# EAGLE design dds (EAGLE 6.2)
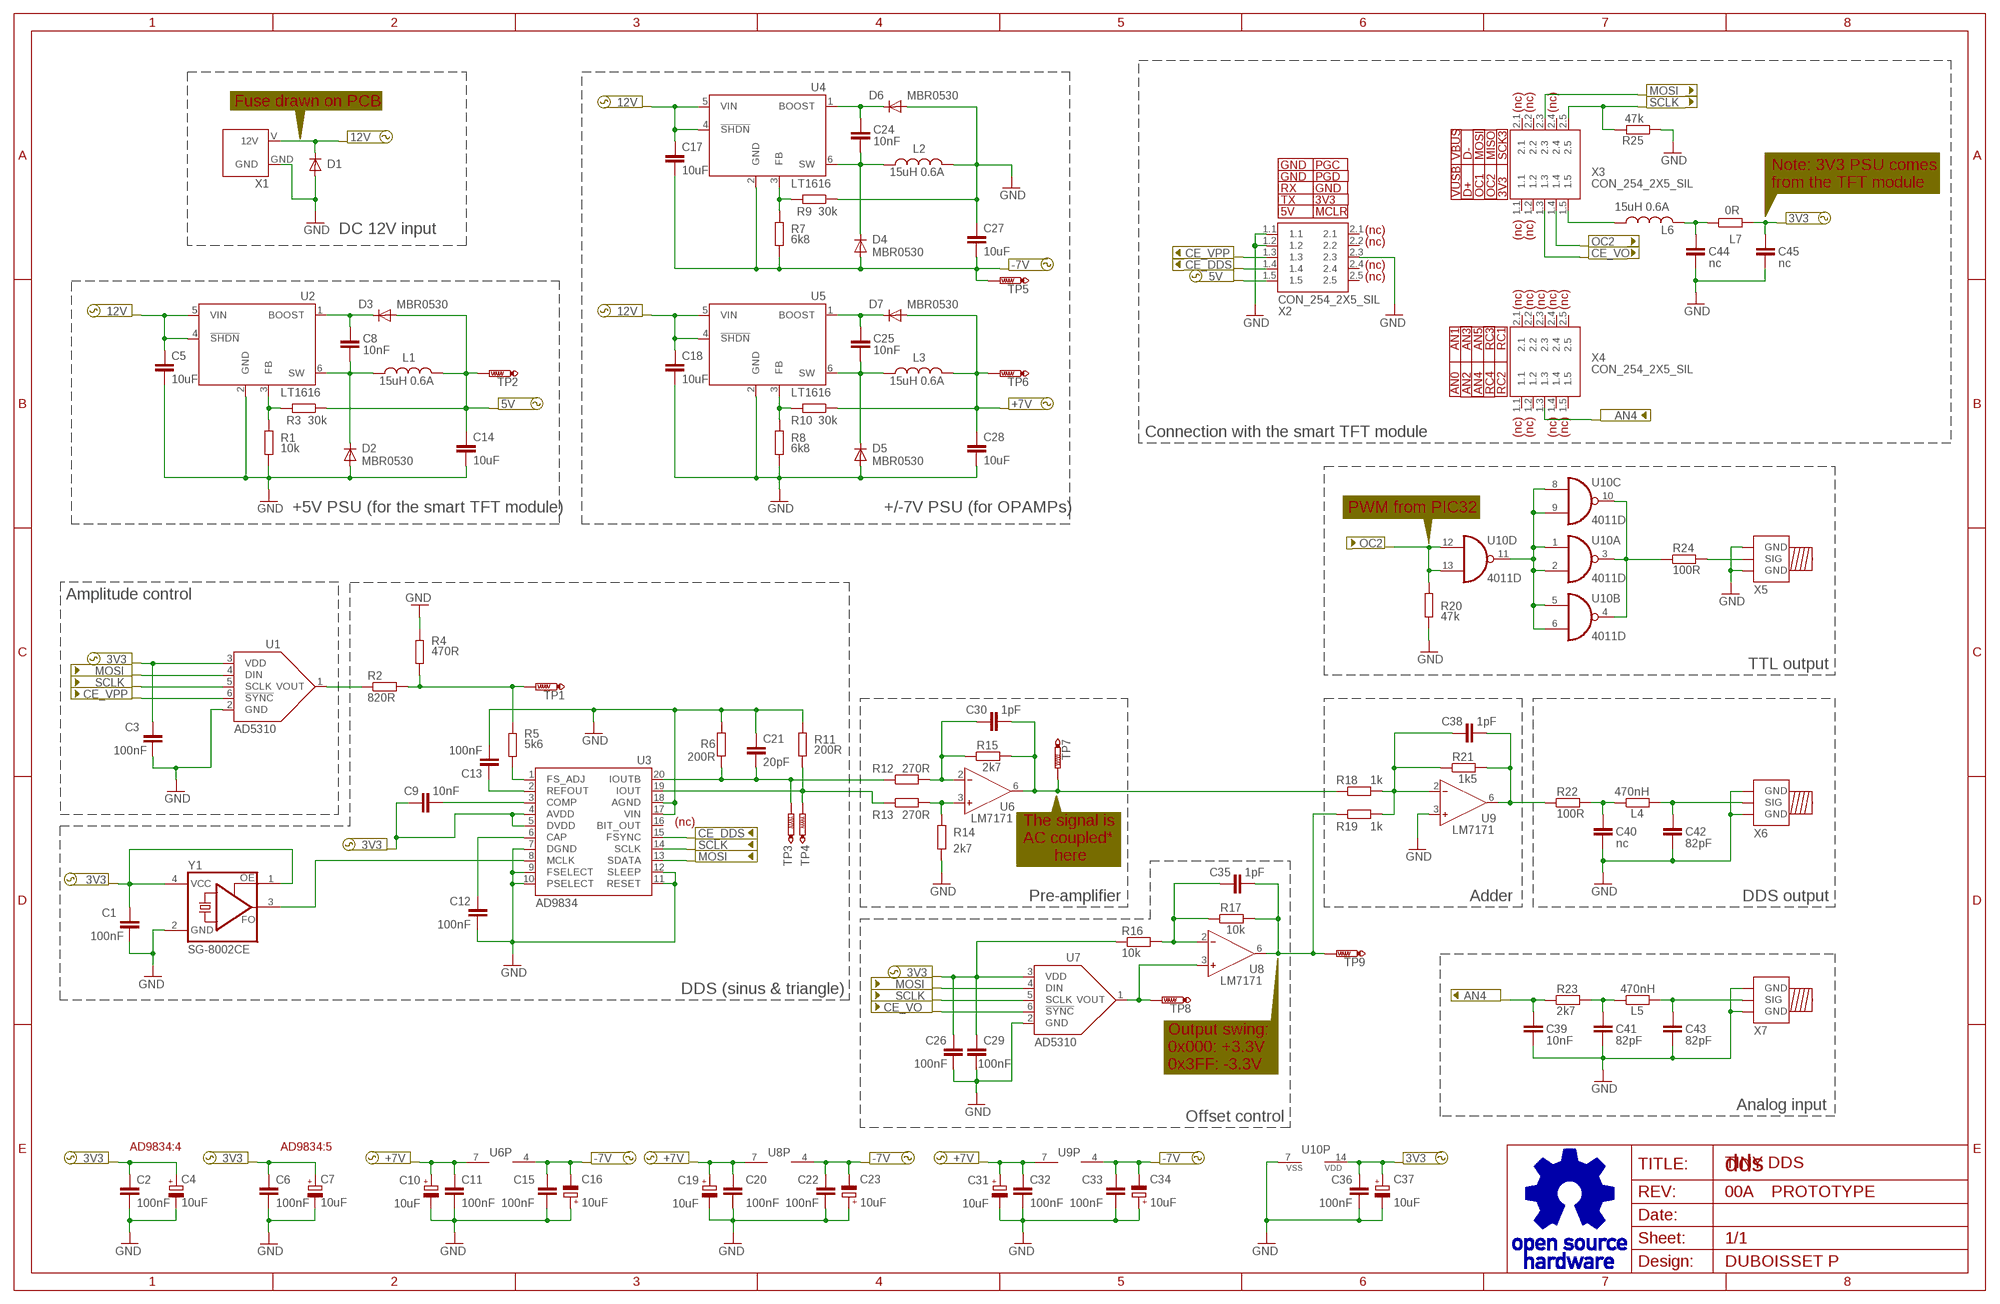
[diagram p0: schematic, sheet 1]

## Parts
C1  100nF  C-EUC0603  [C0603]
C2  100nF  C-EUC0603  [C0603]
C3  100nF  C-EUC0603  [C0603]
C4  10uF  CPOL-EUSMCB  [SMC_B]
C5  10uF  C-EUC0805  [C0805]
C6  100nF  C-EUC0603  [C0603]
C7  10uF  CPOL-EUSMCB  [SMC_B]
C8  10nF  C-EUC0603  [C0603]
C9  10nF  C-EUC0603  [C0603]
C10  10uF  CPOL-EUSMCB  [SMC_B]
C11  100nF  C-EUC0603  [C0603]
C12  100nF  C-EUC0603  [C0603]
C13  100nF  C-EUC0603  [C0603]
C14  10uF  C-EUC0805  [C0805]
C15  100nF  C-EUC0603  [C0603]
C16  10uF  CPOL-EUSMCB  [SMC_B]
C17  10uF  C-EUC0805  [C0805]
C18  10uF  C-EUC0805  [C0805]
C19  10uF  CPOL-EUSMCB  [SMC_B]
C20  100nF  C-EUC0603  [C0603]
C21  20pF  C-EUC0603  [C0603]
C22  100nF  C-EUC0603  [C0603]
C23  10uF  CPOL-EUSMCB  [SMC_B]
C24  10nF  C-EUC0603  [C0603]
C25  10nF  C-EUC0603  [C0603]
C26  100nF  C-EUC0603  [C0603]
C27  10uF  C-EUC0805  [C0805]
C28  10uF  C-EUC0805  [C0805]
C29  100nF  C-EUC0603  [C0603]
C30  1pF  C-EUC0603  [C0603]
C31  10uF  CPOL-EUSMCB  [SMC_B]
C32  100nF  C-EUC0603  [C0603]
C33  100nF  C-EUC0603  [C0603]
C34  10uF  CPOL-EUSMCB  [SMC_B]
C35  1pF  C-EUC0603  [C0603]
C36  100nF  C-EUC0603  [C0603]
C37  10uF  CPOL-EUSMCB  [SMC_B]
C38  1pF  C-EUC0603  [C0603]
C39  10nF  C-EUC0603  [C0603]
C40  nc  C-EUC0603  [C0603]
C41  82pF  C-EUC0603  [C0603]
C42  82pF  C-EUC0603  [C0603]
C43  82pF  C-EUC0603  [C0603]
C44  nc  C-EUC0603  [C0603]
C45  nc  C-EUC0603  [C0603]
D1  DIODE-SMB  [SMB]
D2  MBR0530  DIODE-SOD123  [SOD123]
D3  MBR0530  DIODE-SOD123  [SOD123]
D4  MBR0530  DIODE-SOD123  [SOD123]
D5  MBR0530  DIODE-SOD123  [SOD123]
D6  MBR0530  DIODE-SOD123  [SOD123]
D7  MBR0530  DIODE-SOD123  [SOD123]
L1  15uH 0.6A  L_TDK_15UH  [L5X3]
L2  15uH 0.6A  L_TDK_15UH  [L5X3]
L3  15uH 0.6A  L_TDK_15UH  [L5X3]
L4  470nH  R-EU_R0603  [R0603]
L5  470nH  R-EU_R0603  [R0603]
L6  15uH 0.6A  L_TDK_15UH  [L5X3]
L7  0R  R-EU_R0603  [R0603]
R1  10k  R-EU_R0603  [R0603]
R2  820R  R-EU_R0603  [R0603]
R3  30k  R-EU_R0603  [R0603]
R4  470R  R-EU_R0603  [R0603]
R5  5k6  R-EU_R0603  [R0603]
R6  200R  R-EU_R0603  [R0603]
R7  6k8  R-EU_R0603  [R0603]
R8  6k8  R-EU_R0603  [R0603]
R9  30k  R-EU_R0603  [R0603]
R10  30k  R-EU_R0603  [R0603]
R11  200R  R-EU_R0603  [R0603]
R12  270R  R-EU_R0603  [R0603]
R13  270R  R-EU_R0603  [R0603]
R14  2k7  R-EU_R0603  [R0603]
R15  2k7  R-EU_R0603  [R0603]
R16  10k  R-EU_R0603  [R0603]
R17  10k  R-EU_R0603  [R0603]
R18  1k  R-EU_R0603  [R0603]
R19  1k  R-EU_R0603  [R0603]
R20  47k  R-EU_R0603  [R0603]
R21  1k5  R-EU_R0603  [R0603]
R22  100R  R-EU_R0603  [R0603]
R23  2k7  R-EU_R0603  [R0603]
R24  100R  R-EU_R0603  [R0603]
R25  47k  R-EU_R0603  [R0603]
TP1  PTR1B1,27  [B1,27]
TP2  PTR1B1,27  [B1,27]
TP3  PTR1B1,27  [B1,27]
TP4  PTR1B1,27  [B1,27]
TP5  PTR1B1,27  [B1,27]
TP6  PTR1B1,27  [B1,27]
TP7  PTR1B1,27  [B1,27]
TP8  PTR1B1,27  [B1,27]
TP9  PTR1B1,27  [B1,27]
U1  AD5310  [SOT23-6]
U2  LT1616  [SOT23-6]
U3  AD9834  [TSSOP20]
U4  LT1616  [SOT23-6]
U5  LT1616  [SOT23-6]
U6  LM7171  AD811_SO8  [SO8]
U7  AD5310  [SOT23-6]
U8  LM7171  AD811_SO8  [SO8]
U9  LM7171  AD811_SO8  [SO8]
U10  4011D  [SO14]
X1  CON_12V  [CON_12V]
X2  CON_254_2X5_SIL  [2X5_SIL]
X3  CON_254_2X5_SIL  [2X5_SIL]
X4  CON_254_2X5_SIL  [2X5_SIL]
X5  CON_SMA  [SMA_SMD]
X6  CON_SMA  [SMA_SMD]
X7  CON_SMA  [SMA_SMD]
Y1  SG-8002CE  ASF1  [ASF]

## Nets
3V3: C1.1 C2.1 C3.1 C4.+ C6.1 C7.+ C9.2 C26.1 C29.1 C36.1 C37.+ C45.1 L7.2 R16.1 U1.3(VDD) U3.4(AVDD) U3.5(DVDD) U7.3(VDD) U10.14(P:VDD) Y1.1(OE) Y1.4(VCC)
5V: C14.1 D3.A L1.P$2 R3.1 TP2.TP X2.1.5
12V: C5.1 C17.1 C18.1 D1.C U2.4(!SHDN) U2.5(VIN) U4.4(!SHDN) U4.5(VIN) U5.4(!SHDN) U5.5(VIN) X1.V(12V)
+7V: C10.+ C11.1 C19.+ C20.1 C28.1 C31.+ C32.1 D7.A L3.P$2 R10.1 TP6.TP U6.7(V+) U8.7(V+) U9.7(V+)
-7V: C15.1 C16.- C17.2 C22.1 C23.- C27.2 C33.1 C34.- D4.A R7.1 TP5.TP U4.2(GND) U6.4(V-) U8.4(V-) U9.4(V-)
AN4: C39.1 R23.1 X4.1.3
CE_DDS: U3.15(FSYNC) X2.1.4
CE_VO: U7.6(!SYNC) X3.1.3
CE_VPP: U1.6(!SYNC) X2.1.3
GND: C1.2 C2.2 C3.2 C4.- C5.2 C6.2 C7.- C10.- C11.2 C12.2 C13.2 C14.2 C15.2 C16.+ C18.2 C19.- C20.2 C21.1 C22.2 C23.+ C26.2 C27.1 C28.2 C29.2 C31.- C32.2 C33.2 C34.+ C36.2 C37.- C39.2 C40.2 C41.2 C42.2 C43.2 C44.2 C45.2 D1.A D2.A D5.A D6.A L2.P$2 R1.1 R4.1 R6.2 R8.1 R9.1 R11.2 R14.1 R20.1 R25.1 U1.2(GND) U2.2(GND) U3.7(DGND) U3.9(FSELECT) U3.10(PSELECT) U3.11(RESET) U3.12(SLEEP) U3.17(VIN) U3.18(AGND) U5.2(GND) U7.2(GND) U9.3(IN+) U10.7(P:VSS) X1.GND X2.1.1 X2.1.2 X2.2.3 X5.GND@1(GND) X5.GND@2(GND) X6.GND@1(GND) X6.GND@2(GND) X7.GND@1(GND) X7.GND@2(GND) Y1.2(GND)
MOSI: U1.4(DIN) U3.13(SDATA) U7.4(DIN) X3.2.3
N$1: C21.2 R6.1 R12.1 TP3.TP U3.20(IOUTB)
N$2: C13.1 U3.2(REFOUT)
N$3: C9.1 U3.3(COMP)
N$5: C8.1 D2.C L1.P$1 U2.6(SW)
N$6: R11.1 R13.1 TP4.TP U3.19(IOUT)
N$7: C12.1 U3.6(CAP)
N$8: U3.8(MCLK) Y1.3(FO)
N$9: C30.1 R12.2 R15.1 U6.2(IN-)
N$10: R2.1 U1.1(VOUT)
N$11: C41.1 L5.1 R23.2
N$12: R5.2 U3.1(FS_ADJ)
N$13: R13.2 R14.2 U6.3(IN+)
N$14: C30.2 R15.2 R18.1 TP7.TP U6.6(OUT)
N$15: C40.1 L4.1 R22.2
N$16: TP8.TP U7.1(VOUT) U8.3(IN+)
N$17: C35.1 R16.2 R17.1 U8.2(IN-)
N$18: C38.1 R18.2 R19.2 R21.1 U9.2(IN-)
N$19: C35.2 R17.2 R19.1 TP9.TP U8.6(OUT)
N$20: C38.2 R21.2 R22.1 U9.6(OUT)
N$21: C8.2 D3.C U2.1(BOOST)
N$22: C24.1 D4.C L2.P$1 U4.6(SW)
N$23: C25.1 D5.C L3.P$1 U5.6(SW)
N$24: R1.2 R3.2 U2.3(FB)
N$25: C25.2 D7.C U5.1(BOOST)
N$26: R2.2 R4.2 R5.1 TP1.TP
N$27: R8.2 R10.2 U5.3(FB)
N$28: C24.2 D6.C U4.1(BOOST)
N$29: R7.2 R9.2 U4.3(FB)
N$30: C42.1 L4.2 X6.SIG
N$31: C43.1 L5.2 X7.SIG
N$32: U10.1(A:I0) U10.2(A:I1) U10.5(B:I0) U10.6(B:I1) U10.8(C:I0) U10.9(C:I1) U10.11(D:O)
N$33: R24.1 U10.3(A:O) U10.4(B:O) U10.10(C:O)
N$34: R24.2 X5.SIG
N$35: C44.1 L6.P$2 L7.1
N$37: L6.P$1 X3.1.5
OC2: R20.2 U10.12(D:I0) U10.13(D:I1) X3.1.4
SCLK: R25.2 U1.5(SCLK) U3.14(SCLK) U7.5(SCLK) X3.2.5
Unconnected: U3.16(BIT_OUT) U6.1(NC) U6.5(NC) U6.8(NC) U8.1(NC) U8.5(NC) U8.8(NC) U9.1(NC) U9.5(NC) U9.8(NC) X2.2.1 X2.2.2 X2.2.4 X2.2.5 X3.1.1 X3.1.2 X3.2.1 X3.2.2 X3.2.4 X4.1.1 X4.1.2 X4.1.4 X4.1.5 X4.2.1 X4.2.2 X4.2.3 X4.2.4 X4.2.5

## Notes on the sheet
- Fuse drawn on PCB
- (nc) | (nc) | (nc)
- VBUS | D- | MOSI | MISO | SCK3
- GND | PGC | Note: 3V3 PSU comes
- GND | PGD
- from the TFT module
- RX | GND
- VUSB | D+ | OC1 | OC2 | 3V3
- TX | 3V3
- 5V | !MCLR
- DC 12V input | (nc)
- (nc) | (nc)
- (nc)
- (nc)
- (nc)
- (nc) | (nc) | (nc) | (nc) | (nc)
- AN1 | AN3 | AN5 | RC3 | RC1
- AN0 | AN2 | AN4 | RC4 | RC2
- Connection with the smart TFT module | (nc) | (nc) | (nc) | (nc)
- +5V PSU (for the smart TFT module) | +/-7V PSU (for OPAMPs) | PWM from PIC32
- Amplitude control
- TTL output
- (nc) | The signal is
- AC coupled*
- here
- Pre-amplifier | Adder | DDS output
- DDS (sinus & triangle)
- Output swing:
- 0x000: +3.3V
- 0x3FF: -3.3V
- Analog input
- Offset control
- AD9834:4 | AD9834:5
- TINY DDS
- 00A | PROTOTYPE

## Library data of the parts
C1-C3 C5 C6 C8 C9 C11-C15 C17 C18 C20-C22 C24-C30 C32 C33 C35 C36 C38-C45 = rcl:C-EU: CAPACITOR, European symbol
C4 C7 C10 C16 C19 C23 C31 C34 C37 = rcl:CPOL-EU: POLARIZED CAPACITOR, European symbol
D1-D7 = diode:DIODE-: DIODE
L1-L3 L6 = tft:L_TDK_15UH
L4 L5 L7 R1-R25 = rcl:R-EU_: RESISTOR, European symbol
TP1-TP9 = testpad:PTR1: TEST PIN
U1 U7 = tft:AD5310
U2 U4 U5 = tft:LT1616
U3 = tft:AD9834
U6 U8 U9 = analog-devices:AD811_SO8: ANALOG DEVICES; MF: ALTERA CORPORATION; MPN: AD811JRZ; OC_FARNELL: unknown; OC_NEWARK: 82H2980
U10 = 40xx:4011: Quad 2-input NAND
X1 = tft:CON_12V
X2-X4 = con254:CON_254_2X5_SIL
X5-X7 = tft:CON_SMA
Y1 = crystal:ASF*: CRYSTAL CLOCK OSCILLATORS 5.0 Vdc or 3.3 Vdc - LOW PROFILE ULTRA MINIATURE CERAMIC SURFACE MOUNT Source: http://www.abracon.com/Oscillators/asf1-L-L1.pdf; OC_FARNELL: unknown; OC_NEWARK: unknown

## Board
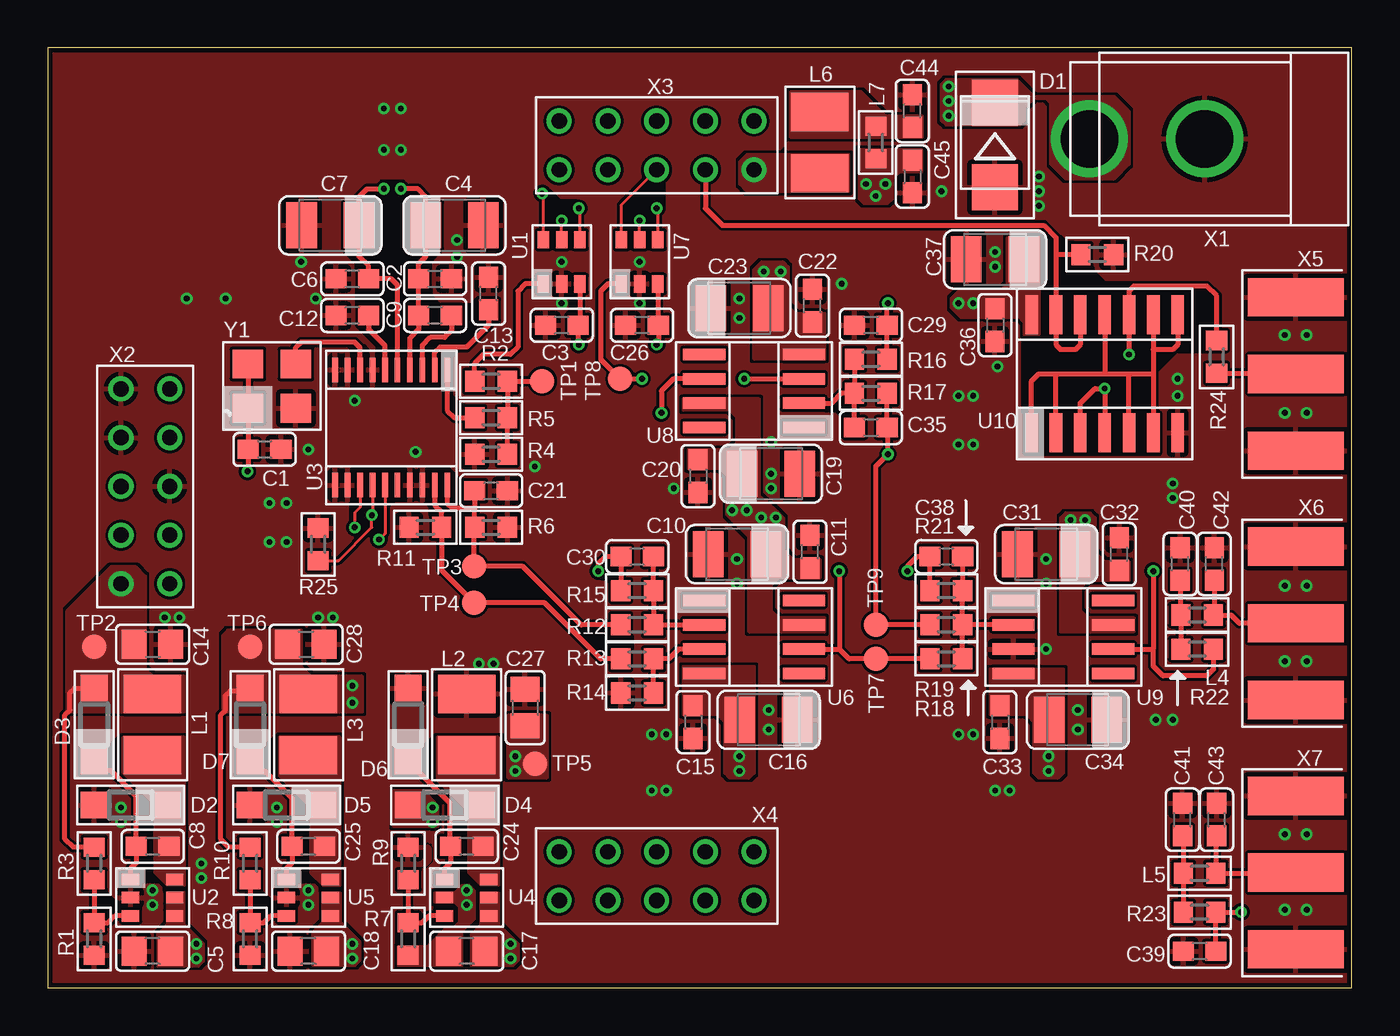
[diagram p1: board, top side]
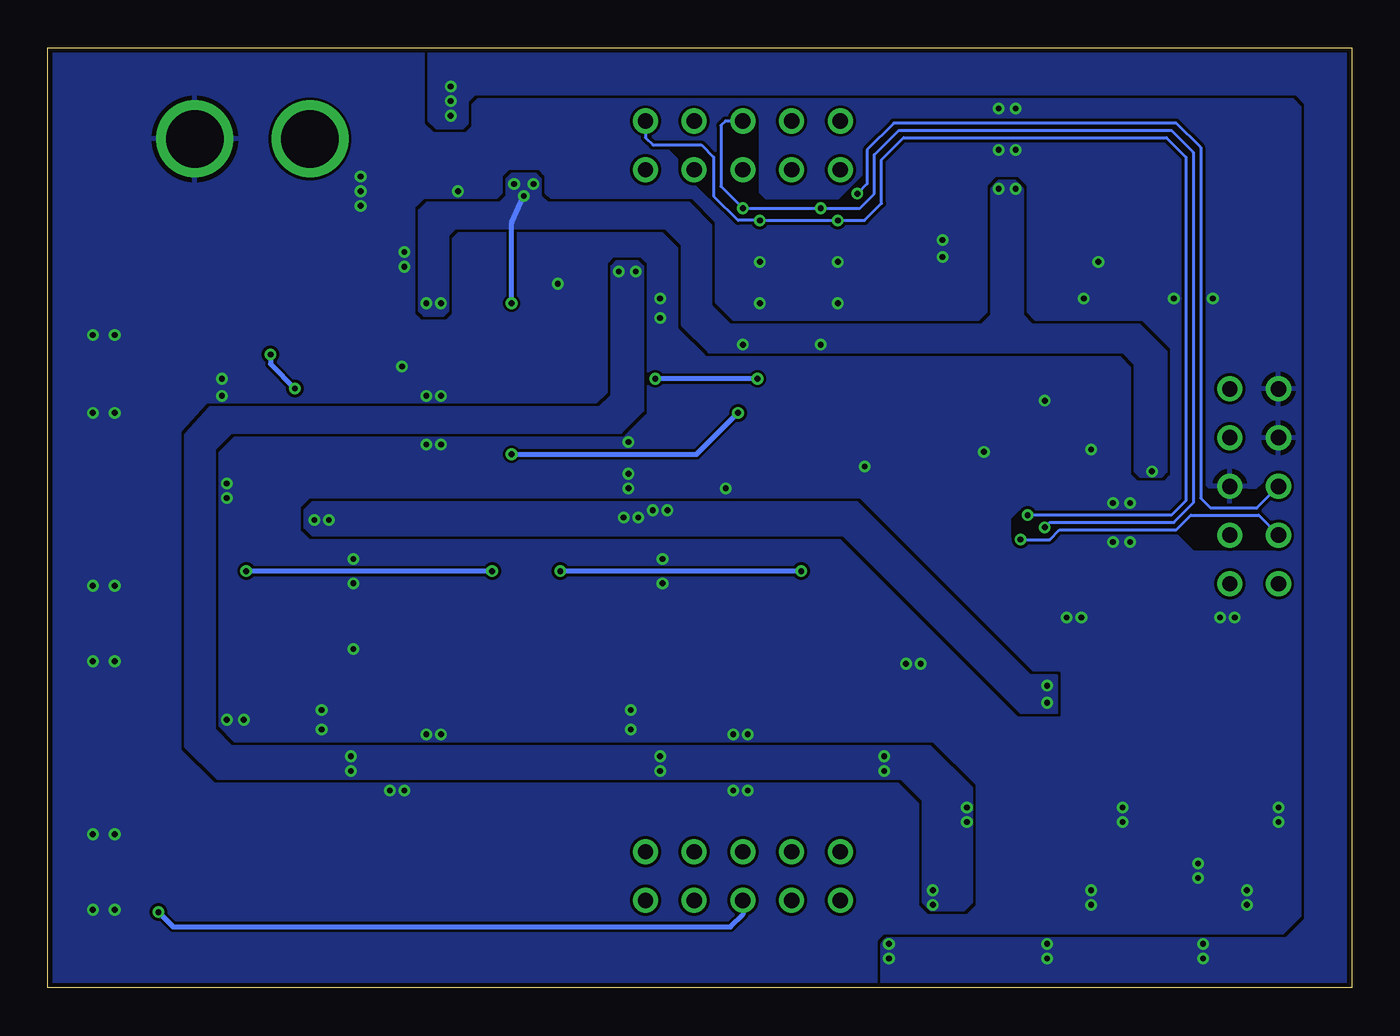
[diagram p2: board, bottom side, seen from below]

Size 68 x 49 mm. Coordinates in mm from the lower left corner, seen from the top.
Outline: 0,0 68,0 68,49 0,49 0,0
Copper layers (1*16): Top 0.035mm / dielectric 1.5mm / Bottom 0.035mm
Design rules: minimum track width 6mil, minimum drill 0.3mm, track to track 6mil, track to pad 6mil, pad to pad 6mil, via to via 6mil, smd to smd 0mil, copper to edge 10mil, drill to drill 10mil, minimum pad ring 10mil, minimum via ring 6mil, stop-mask expansion 2mil, vias tented up to drill 100mil, thermal gap 10mil
tRestrict: 90 lines
bRestrict: 15 lines

### Footprints (pad centres in the part's own frame; a part is rotated, then mirrored left to right if it is on the bottom)
C0603 = smd 1.1 x 1: 1 -0.85,0; 2 0.85,0
SMC_B = smd 1.6 x 2.4: + -1.5,0; - 1.5,0
C0805 = smd 1.3 x 1.5: 1 -0.95,0; 2 0.95,0
SMB = smd 2.4 x 2.4: A 2.2,0; C -2.2,0
SOD123 = smd 1.4 x 1.4: A 1.9,0; C -1.9,0
L5X3 = smd 2 x 3: P$1 -1.6,0; P$2 1.6,0
R0603 = smd 1 x 1.1: 1 -0.85,0; 2 0.85,0
B1,27 = smd 1.27 x 1.27: TP 0,0
SOT23-6 = smd 0.6 x 0.9: 1 -0.95,-1.15; 2 0,-1.15; 3 0.95,-1.15; 4 0.95,1.15; 5 0,1.15; 6 -0.95,1.15
TSSOP20 = smd 0.3 x 1.27: 1 -2.925,-3; 2 -2.275,-3; 3 -1.625,-3; 4 -0.975,-3; 5 -0.325,-3; 6 0.325,-3; 7 0.975,-3; 8 1.625,-3; 9 2.275,-3; 10 2.925,-3; 11 2.925,3; 12 2.275,3; 13 1.625,3; 14 0.975,3; 15 0.325,3; 16 -0.325,3; 17 -0.975,3; 18 -1.625,3; 19 -2.275,3; 20 -2.925,3
SO8 = smd 0.6 x 2.2: 1 -1.905,-2.6; 2 -0.635,-2.6; 3 0.635,-2.6; 4 1.905,-2.6; 5 1.905,2.6; 6 0.635,2.6; 7 -0.635,2.6; 8 -1.905,2.6
SO14 = smd 0.66 x 2.032: 1 -3.81,-3.073; 2 -2.54,-3.073; 3 -1.27,-3.073; 4 0,-3.073; 5 1.27,-3.073; 6 2.54,-3.073; 7 3.81,-3.073; 8 3.81,3.073; 9 2.54,3.073; 10 1.27,3.073; 11 0,3.073; 12 -1.27,3.073; 13 -2.54,3.073; 14 -3.81,3.073
CON_12V = drill 3: GND 0,0; V 6,0
2X5_SIL = drill 0.8: 1.1 -1.27,5.08; 1.2 -1.27,2.54; 1.3 -1.27,0; 1.4 -1.27,-2.54; 1.5 -1.27,-5.08; 2.1 1.27,5.08; 2.2 1.27,2.54; 2.3 1.27,0; 2.4 1.27,-2.54; 2.5 1.27,-5.08
SMA_SMD = smd 2 x 5: GND@1 -4,0; GND@2 4,0; SIG 0,0
ASF = smd 1.6 x 1.5: 1 -1.25,-1.15; 2 1.25,-1.15; 3 1.25,1.15; 4 -1.25,1.15

### Placement (x,y rotation side)
C1  11.3,28.07 0 top
C2  20.19,36.96 0 top
C3  26.8,34.54 180 top
C4  21.21,39.75 0 top
C5  5.46,1.91 180 top
C6  15.88,36.96 180 top
C7  14.73,39.75 180 top
C8  5.46,7.37 180 top
C9  20.19,35.05 180 top
C10  35.94,22.61 180 top
C11  39.75,22.73 90 top
C12  15.88,35.05 180 top
C13  22.99,36.2 90 top
C14  5.46,17.91 0 top
C15  33.66,13.84 270 top
C16  37.59,13.97 180 top
C17  21.84,1.91 180 top
C18  13.59,1.91 180 top
C19  37.72,26.8 0 top
C20  33.91,26.67 270 top
C21  23.11,25.91 180 top
C22  39.88,35.56 90 top
C23  36.07,35.43 0 top
C24  21.84,7.37 180 top
C25  13.59,7.37 180 top
C26  30.99,34.54 180 top
C27  24.89,14.61 270 top
C28  13.46,17.91 0 top
C29  42.93,34.54 180 top
C30  30.73,22.48 180 top
C31  52.07,22.61 180 top
C32  55.88,22.61 90 top
C33  49.66,13.84 270 top
C34  53.72,13.97 180 top
C35  42.93,29.21 0 top
C36  49.4,34.54 270 top
C37  49.4,37.97 180 top
C38  46.86,22.48 180 top
C39  60.07,1.91 180 top
C40  59.05,22.1 90 top
C41  59.18,8.76 90 top
C42  60.83,22.1 90 top
C43  60.96,8.76 90 top
C44  45.09,45.72 90 top
C45  45.09,42.29 270 top
D1  49.4,43.94 270 top
D2  4.32,9.53 180 top
D3  2.41,13.72 90 top
D4  20.7,9.53 180 top
D5  12.45,9.53 180 top
D6  18.8,13.72 90 top
D7  10.54,13.72 90 top
L1  5.46,13.72 90 top
L2  21.84,13.72 90 top
L3  13.59,13.72 90 top
L4  59.94,19.43 0 top
L5  60.07,5.97 0 top
L6  40.26,44.07 90 top
L7  43.18,44.07 270 top
R1  2.41,2.54 90 top
R2  23.11,31.62 0 top
R3  2.41,6.48 270 top
R4  23.11,27.81 0 top
R5  23.11,29.72 180 top
R6  23.11,24 0 top
R7  18.8,2.54 90 top
R8  10.54,2.54 90 top
R9  18.8,6.48 270 top
R10  10.54,6.48 270 top
R11  19.68,24 180 top
R12  30.73,18.92 0 top
R13  30.73,17.14 0 top
R14  30.73,15.37 0 top
R15  30.73,20.7 180 top
R16  42.93,32.77 180 top
R17  42.93,30.99 0 top
R18  46.86,17.14 0 top
R19  46.86,18.92 0 top
R20  54.74,38.23 180 top
R21  46.86,20.7 180 top
R22  59.94,17.65 180 top
R23  60.07,3.94 180 top
R24  60.96,32.89 270 top
R25  14.1,23.11 270 top
TP1  25.78,31.62 180 top
TP2  2.41,17.78 0 top
TP3  22.23,21.97 90 top
TP4  22.23,20.07 90 top
TP5  25.4,11.68 0 top
TP6  10.54,17.78 0 top
TP7  43.18,17.14 0 top
TP8  29.84,31.75 180 top
TP9  43.18,18.92 0 top
U1  26.8,37.85 0 top
U2  5.46,4.7 270 top
U3  17.91,29.21 180 top
U4  21.84,4.7 270 top
U5  13.59,4.7 270 top
U6  36.83,18.29 270 top
U7  30.86,37.85 0 top
U8  36.83,31.11 90 top
U9  52.96,18.29 270 top
U10  55.12,32 0 top
X1  60.33,44.25 180 top
X2  5.08,26.14 0 top
X3  31.75,43.92 90 top
X4  31.75,5.82 90 top
X5  65.1,32 270 top
X6  65.1,19 270 top
X7  65.1,6 270 top
Y1  11.68,31.37 0 top

### Tracks (layer width: path | path; a pad name or v marks a point on that pad's centre or on a via)
3V3  (via drill 0.3)
  Top 0.254: v43.81,35.69 43.78,35.65 C29.1 R16.1 | U7.3 31.81,34.64 C26.1 31.84,33.69 v31.75,33.53 | U1.3 27.75,34.64 C3.1 27.65,33.57 v27.69,33.53 | Y1.4 Y1.1 10.43,28.09 C1.1 10.45,26.96 v10.41,26.92 | v17.53,41.66 16.64,41.66 16.23,41.25 C7.+ 16.23,38.12 16.73,37.63 C6.1 17.91,36.96 18.23,36.63 U3.5 | U3.4 18.88,33.87 19.34,34.33 C9.2 C2.1 19.34,37.76 19.71,38.12 C4.+ 19.71,41.25 19.3,41.66 v18.41,41.66
  Bottom 0.254: v43.81,35.69 43.81,39.88 v43.18,41.27
  other vias: 42.67,41.91 43.69,41.91 47.5,35.69 48.26,35.69
  pour Top (no thermals): 45.59,43.69 42.42,43.69 42.29,43.69 42.29,41.15 42.55,40.89 43.81,40.89 44.07,41.15 44.07,42.16 44.45,42.55 45.59,42.55
  pour Bottom: 19.3,34.54 32.38,34.54 33.4,35.56 33.4,39.75 34.54,40.89 41.91,40.89 42.29,41.27 42.29,42.16 42.55,42.42 43.81,42.42 44.07,42.16 44.07,41.27 44.45,40.89 48.26,40.89 48.64,40.51 48.64,35.31 48.39,35.05 47.37,35.05 47.12,35.31 47.12,39.24 46.74,39.62 35.81,39.62 34.92,38.73 34.92,34.54 33.53,33.15 11.94,33.15 11.3,32.51 11.3,26.92 11.05,26.67 9.91,26.67 9.65,26.92 9.65,33.15 11.05,34.54 16.64,34.54 17.14,35.05 17.14,41.66 17.53,42.04 18.41,42.04 18.8,41.66 18.8,35.05
  pour Top (no thermals): 51.69,39.12 51.69,34.04 50.93,34.04 50.93,34.67 50.67,34.92 47.62,34.92 47.12,35.43 47.12,35.94 47.62,36.45 49.78,36.45 50.04,36.7 50.04,39.12
5V
  Top 0.254: R3.1 1.31,7.33 0.89,7.75 0.89,14.22 1.14,14.48 1.14,15.37 1.4,15.62 D3.A
  pour Top (no thermals): 3.3,21.97 4.57,21.97 5.08,21.46 5.08,16.64 5.46,16.26 7.11,16.26 7.11,14.35 1.02,14.35 1.02,19.68
12V  (via drill 0.3)
  other vias: 46.99,45.47 46.99,46.23 46.99,46.99 7.75,2.29 7.75,1.52 15.88,2.29 15.88,1.52 24.13,2.29 24.13,1.52
  pour Top (no thermals): 46.86,47.37 50.55,47.37 51.44,46.48 55.63,46.48 56.39,45.72 56.39,42.93 55.63,42.16 53.09,42.16 52.32,42.93 52.32,46.1 52.07,46.35 51.44,46.35 50.93,45.85 50.93,45.21 50.67,44.96 46.86,44.96 46.61,45.21 46.61,47.12
  pour Top (no thermals): 6.22,4.95 6.22,3.3 5.71,2.79 5.71,1.14 7.87,1.14 8.13,1.4 8.13,2.29 7.11,3.3 7.11,4.95
  pour Top (no thermals): 15.24,4.95 15.24,3.43 16.26,2.41 16.26,1.4 16,1.14 13.84,1.14 13.84,2.92 14.35,3.43 14.35,4.95
  pour Top (no thermals): 22.61,4.95 23.5,4.95 23.5,3.3 24.51,2.29 24.51,1.4 24.26,1.14 22.1,1.14 22.1,2.79 22.61,3.3
  pour Bottom: 24.51,2.29 24.51,-0.13 -0.13,-0.13 -0.13,49.15 48.13,49.15 48.13,45.21 47.75,44.83 46.35,44.83 46.1,45.09 46.1,46.23 45.72,46.61 2.92,46.61 2.41,46.1 2.41,3.56 3.43,2.54 24.26,2.54
+7V  (via drill 0.3)
  Top 0.254: R10.1 9.44,7.33 9.02,7.75 9.02,14.22 9.27,14.48 9.27,15.24 9.53,15.49 10.54,15.49 D7.A
  other vias: 37.21,24.51 37.97,24.51 53.34,24.38 54.1,24.38 15.88,15.75 15.88,14.86 35.69,24.89 36.45,24.89
  pour Top (no thermals): 16.38,16.26 16.38,14.35 9.14,14.35 9.14,18.41 9.4,18.67 13.21,18.67 13.21,16.76 13.72,16.26
  pour Top (no thermals): 40.51,19.3 40.51,18.54 36.58,18.54 36.58,23.5 35.43,24.64 35.43,26.67 35.05,27.05 33.4,27.05 33.4,28.07 35.56,28.07 35.94,28.45 35.94,29.72 35.56,30.1 33.15,30.1 33.15,30.73 37.08,30.73 37.08,25.65 38.1,24.77 38.35,24.51 38.35,22.86 38.86,22.35 40.26,22.35 40.26,21.34 38.1,21.34 37.72,20.95 37.72,19.68 38.1,19.3
  pour Top (no thermals): 53.09,24.77 54.36,24.77 54.61,24.51 54.61,22.73 55.12,22.23 56.39,22.23 56.39,21.21 54.23,21.21 53.85,20.83 53.85,19.68 54.23,19.3 56.64,19.3 56.64,18.54 52.83,18.54 52.83,24.51
  pour Bottom: 54.23,23.62 26.54,23.62 17.27,14.35 15.37,14.35 15.37,16.26 16.76,16.26 25.78,25.27 54.23,25.27 54.61,24.89 54.61,24
-7V  (via drill 0.3)
  other vias: 21.84,5.08 21.84,4.32 20.07,9.4 20.07,8.64 24.38,12.06 24.38,11.3 52.2,11.3 52.2,12.06 36.07,12.06 36.07,11.3 37.34,37.34 38.23,37.34
  pour Top (no thermals): 20.19,4.95 21.21,4.95 21.59,5.33 21.97,5.33 22.23,5.08 22.23,3.56 21.59,2.92 21.59,1.14 18.29,1.14 18.29,2.16 19.81,2.16 20.83,3.17 21.21,3.17 21.46,3.43 21.46,4.19 21.21,4.45 20.19,4.45
  pour Top (no thermals): 18.03,10.29 19.56,10.29 20.32,9.53 20.32,8.38 18.03,8.38
  pour Top (no thermals): 24,14.22 26.04,14.22 26.04,10.92 24,10.92
  pour Bottom: 21.97,12.57 58.42,12.57 59.31,13.46 59.31,28.07 58.42,28.96 38.1,28.96 36.96,30.1 36.96,37.59 37.21,37.85 38.35,37.85 38.61,37.59 38.61,30.86 39.24,30.23 59.56,30.23 60.83,28.83 60.83,12.57 59.18,10.92 23.5,10.92 22.35,9.78 22.35,4.45 21.97,4.06 20.19,4.06 19.81,4.45 19.81,10.41
  pour Top (no thermals): 49.15,16.64 52.96,16.64 52.96,11.18 52.7,10.92 51.69,10.92 51.44,11.18 51.44,13.84 51.05,14.22 49.15,14.22
  pour Top (no thermals): 33.15,16.76 36.83,16.76 36.83,11.18 36.58,10.92 35.56,10.92 35.31,11.18 35.31,13.84 34.92,14.22 33.15,14.22
  pour Top (no thermals): 37.21,37.85 38.35,37.85 38.61,37.59 38.61,35.56 38.99,35.18 40.51,35.18 40.51,32.77 36.83,32.77 36.83,37.47
AN4  (via drill 0.3)
  Top 0.254: v62.23,3.94 R23.1 C39.1
  Bottom 0.254: v62.23,3.94 61.47,3.17 32.38,3.17 31.75,3.81 X4.1.3
CE_DDS  (via drill 0.3)
  Top 0.152: U3.15 17.58,23.68 v17.27,23.37
  Bottom 0.152: v17.27,23.37 15.75,23.37 15.24,23.88 9.14,23.88 8.38,24.64 4.85,24.64 X2.1.4
CE_VO
  Top 0.152: U7.6 29.91,40.81 X3.1.3
CE_VPP  (via drill 0.3)
  Top 0.152: U1.6 25.85,41.34 v25.78,41.4
  Bottom 0.152: v25.78,41.4 25.27,41.91 25.27,43.69 23.88,45.09 9.14,45.09 7.87,43.81 7.87,25.53 7.37,25.02 4.93,25.02 X2.1.3
GND  (via drill 0.3)
  other vias: 51.69,42.29 51.69,41.53 51.69,40.77 5.46,5.08 5.46,4.32 3.81,9.4 3.81,8.64 11.94,9.4 11.94,8.64 13.59,5.08 13.59,4.32 6.1,19.3 6.86,19.3 14.1,19.3 14.86,19.3 22.48,16.89 23.24,16.89 32.26,13.21 31.5,13.21 37.59,13.46 37.59,14.48 47.5,13.21 48.26,13.21 53.72,13.46 53.72,14.48 35.94,21.08 35.94,22.35 52.07,21.08 52.07,22.35 36.07,35.94 36.07,34.92 37.72,26.8 37.72,26.04 49.4,38.35 49.4,37.59 49.53,32.38 46.61,41.53 52.07,17.65 41.4,36.7 32.64,26.04 26.8,35.69 30.86,35.69 13.59,28.07 16,30.61 19.18,27.94 25.4,27.18 13.21,37.85 13.97,35.94 21.34,38.1 21.34,38.99 64.52,34.04 65.66,34.04 64.52,29.97 65.66,29.97 64.52,20.95 65.66,20.95 64.52,17.02 65.66,17.02 64.52,8 65.66,8 64.52,4.06 65.66,4.06 58.67,26.29 58.67,25.53 49.4,10.29 50.16,10.29 32.26,10.29 31.5,10.29 48.26,30.86 47.5,28.32 48.26,28.32 26.8,37.85 30.86,37.85 17.53,45.85 18.41,45.85 17.53,43.69 18.41,43.69 7.24,35.94 9.27,35.94 11.56,25.27 12.45,25.27 11.56,23.24 12.45,23.24 8,6.48 8,5.71 58.93,30.86 58.93,31.75 37.72,28.45 47.5,30.86 57.78,13.97 58.67,13.97
  pour Bottom (rank 6): -0.51,49.53 68.71,49.53 68.71,-0.51 -0.51,-0.51
  pour Top (rank 6): -0.64,50.42 68.58,50.42 68.58,-0.64 -0.64,-0.64
MOSI  (via drill 0.3)
  Top 0.152: U7.4 31.81,40.58 v31.75,40.64 | U1.4 27.75,40.58 v27.69,40.64 | U3.13 16.28,25.05 16,24.77 v16,24
  Bottom 0.152: X3.2.3 32.66,45.19 32.89,44.96 32.89,41.78 v31.75,40.64 v27.69,40.64 25.65,40.64 24.89,41.4 24.89,43.43 23.62,44.7 9.4,44.7 8.26,43.56 8.26,25.27 9.27,24.26 15.75,24.26 v16,24
N$1
  Top 0.254: U3.20 20.83,25.27 21.08,25.02 22.23,25.02 | 22.23,25.02 22.26,24.98 R6.1 22.23,23.96 TP3.TP 24.77,21.97 27.81,18.92 R12.1 | C21.2 22.26,25.06 22.23,25.02
N$2
  Top 0.254: C13.1 22.99,34.54 21.84,33.4 20.45,33.4 20.18,33.14 U3.2
N$3
  Top 0.254: C9.1 21.04,34.25 20.7,33.91 19.94,33.91 19.53,33.5 U3.3
N$5
  pour Top (no thermals): 3.94,13.08 7.11,13.08 7.11,5.33 6.22,5.33 5.59,5.97 5.59,9.53 3.94,11.18
N$6
  Top 0.254: U3.19 20.18,25.16 20.54,24.8 R11.1 20.54,21.76 TP4.TP 25.91,20.07 28.83,17.14 R13.1
N$7
  Top 0.254: U3.6 17.58,33.47 16.73,34.33 C12.1
N$8
  Top 0.254: U3.8 16.28,33.38 16,33.66 13.21,33.66 12.93,33.38 Y1.3
N$9
  Top 0.254: U6.2 R12.2 R15.1 C30.1
N$10
  Top 0.254: U1.1 24.89,36.7 24.51,36.32 24.51,33.4 24.13,33.02 22.73,33.02 22.26,32.55 R2.1
N$11
  Top 0.254: C41.1 59.22,7.91 L5.1 R23.2
N$12
  Top 0.254: U3.1 20.83,30.09 21.21,29.72 R5.2
N$13
  Top 0.254: U6.3 32.89,17.65 32.38,17.14 R13.2 R14.2
N$14  (via drill 0.3)
  Top 0.254: R18.1 TP7.TP 41.78,17.14 41.27,17.65 | U6.6 41.27,17.65 | v28.7,21.72 28.7,22.1 29.08,22.48 C30.2 R15.2 | v41.27,21.72 41.27,17.65
  Bottom 0.254: v28.7,21.72 v41.27,21.72
N$15
  Top 0.254: C40.1 59.05,19.47 L4.1 R22.2
N$16  (via drill 0.3)
  Top 0.254: v30.99,31.75 TP8.TP 28.83,32.77 28.83,36.32 29.2,36.7 U7.1 | v36.32,31.75 U8.3
  Bottom 0.254: v30.99,31.75 v36.32,31.75
N$17
  Top 0.254: R16.2 R17.1 | C35.1 R17.1 | U8.2 40.89,30.48 41.4,30.99 R17.1
N$18
  Top 0.254: U9.2 R19.2 | C38.1 R21.1 R19.2 | R18.2 R19.2
N$19  (via drill 0.3)
  Top 0.254: R19.1 TP9.TP 43.18,27.18 v43.81,27.81 43.81,29.17 C35.2 R17.2 | U8.6 32.64,31.75 32,31.11 v32,29.97
  Bottom 0.254: v43.81,27.81 34.16,27.81 v32,29.97
N$20  (via drill 0.3)
  Top 0.254: U9.6 57.66,17.65 | v44.83,21.72 44.83,21.97 45.34,22.48 C38.2 R21.2 | v57.66,21.72 57.66,17.65 | R22.1 60.79,16.6 60.45,16.26 58.17,16.26 57.66,16.76 57.66,17.65
  Bottom 0.254: v44.83,21.72 v57.66,21.72
N$21
  Top 0.254: U2.1 4.31,6.22 4.61,6.52 C8.2 4.61,9.99 3.3,11.3 2.41,11.3 D3.C
N$22
  pour Top (no thermals): 20.32,13.08 23.5,13.08 23.5,5.33 22.61,5.33 21.97,5.97 21.97,9.14 20.32,10.79
N$23
  pour Top (no thermals): 15.24,5.33 15.24,13.08 12.06,13.08 12.06,11.05 13.72,9.4 13.72,5.97 14.35,5.33
N$24
  Top 0.254: R3.2 R1.2 3.14,3.39 3.5,3.75 U2.3
N$25
  Top 0.254: U5.1 12.44,6.22 12.74,6.52 C25.2 12.74,9.87 11.3,11.3 11.05,11.3 D7.C
N$26
  Top 0.254: R4.2 R5.1 R2.2 TP1.TP
N$27
  Top 0.254: R10.2 R8.2 11.26,3.39 11.62,3.75 U5.3
N$28
  Top 0.254: D6.C 20.95,9.65 20.95,7.41 C24.2 20.99,6.52 20.69,6.22 U4.1
N$29
  Top 0.254: R9.2 R7.2 19.52,3.39 19.88,3.75 U4.3
N$30
  Top 0.254: X6.SIG 62.15,19 61.72,19.43 L4.2 60.83,19.47 C42.1
N$31
  Top 0.254: X7.SIG 65.1,5.97 L5.2 60.92,7.91 C43.1
N$32
  Top 0.254: U10.9 57.66,33.27 | 57.66,33.27 57.66,32 | 57.66,32 U10.6 | U10.2 52.58,32 | 52.58,32 51.69,32 51.31,31.62 U10.1 | 52.58,32 55.12,32 | 55.12,32 56.39,32 | 56.39,32 57.66,32 | U10.11 55.12,32 | U10.8 58.93,33.53 58.67,33.27 57.66,33.27 | U10.5 56.39,32
N$33  (via drill 0.3)
  Top 0.254: v56.39,33.02 U10.10 56.39,36.32 56.64,36.58 60.45,36.58 60.96,36.07 R24.1 | U10.4 v55.12,31.24 54.61,31.24 53.85,30.48 U10.3
  Bottom 0.254: v56.39,33.02 56.39,32.51 v55.12,31.24
N$34
  Top 0.254: R24.2 65.05,32.04 X5.SIG
N$35
  pour Top (no thermals): 38.73,46.74 42.42,46.74 43.69,45.47 45.59,45.47 45.59,44.32 38.73,44.32
N$37
  pour Top (no thermals): 41.66,43.43 36.45,43.43 36.07,43.05 36.07,41.91 36.45,41.53 41.78,41.53 41.78,43.43
OC2
  Top 0.254: X3.1.4 34.29,40.64 35.18,39.75 51.94,39.75 52.58,39.12 52.58,38.23 | 52.58,38.23 U10.13 52.58,33.53 52.83,33.27 53.59,33.27 53.85,33.53 U10.12 | R20.2 52.58,38.23
SCLK  (via drill 0.3)
  Top 0.152: U7.5 v30.86,40.01 | U1.5 v26.8,40.01 | U3.14 16.93,24.68 v16.89,24.64 16.89,24 15.15,22.26 R25.2
  Bottom 0.152: X3.2.5 36.83,44.32 36.45,43.94 33.91,43.94 33.27,43.31 33.27,41.27 32,40.01 v30.86,40.01 v26.8,40.01 25.4,40.01 24.51,40.89 24.51,43.18 23.37,44.32 9.65,44.32 8.64,43.31 8.64,25.4 9.4,24.64 v16.89,24.64